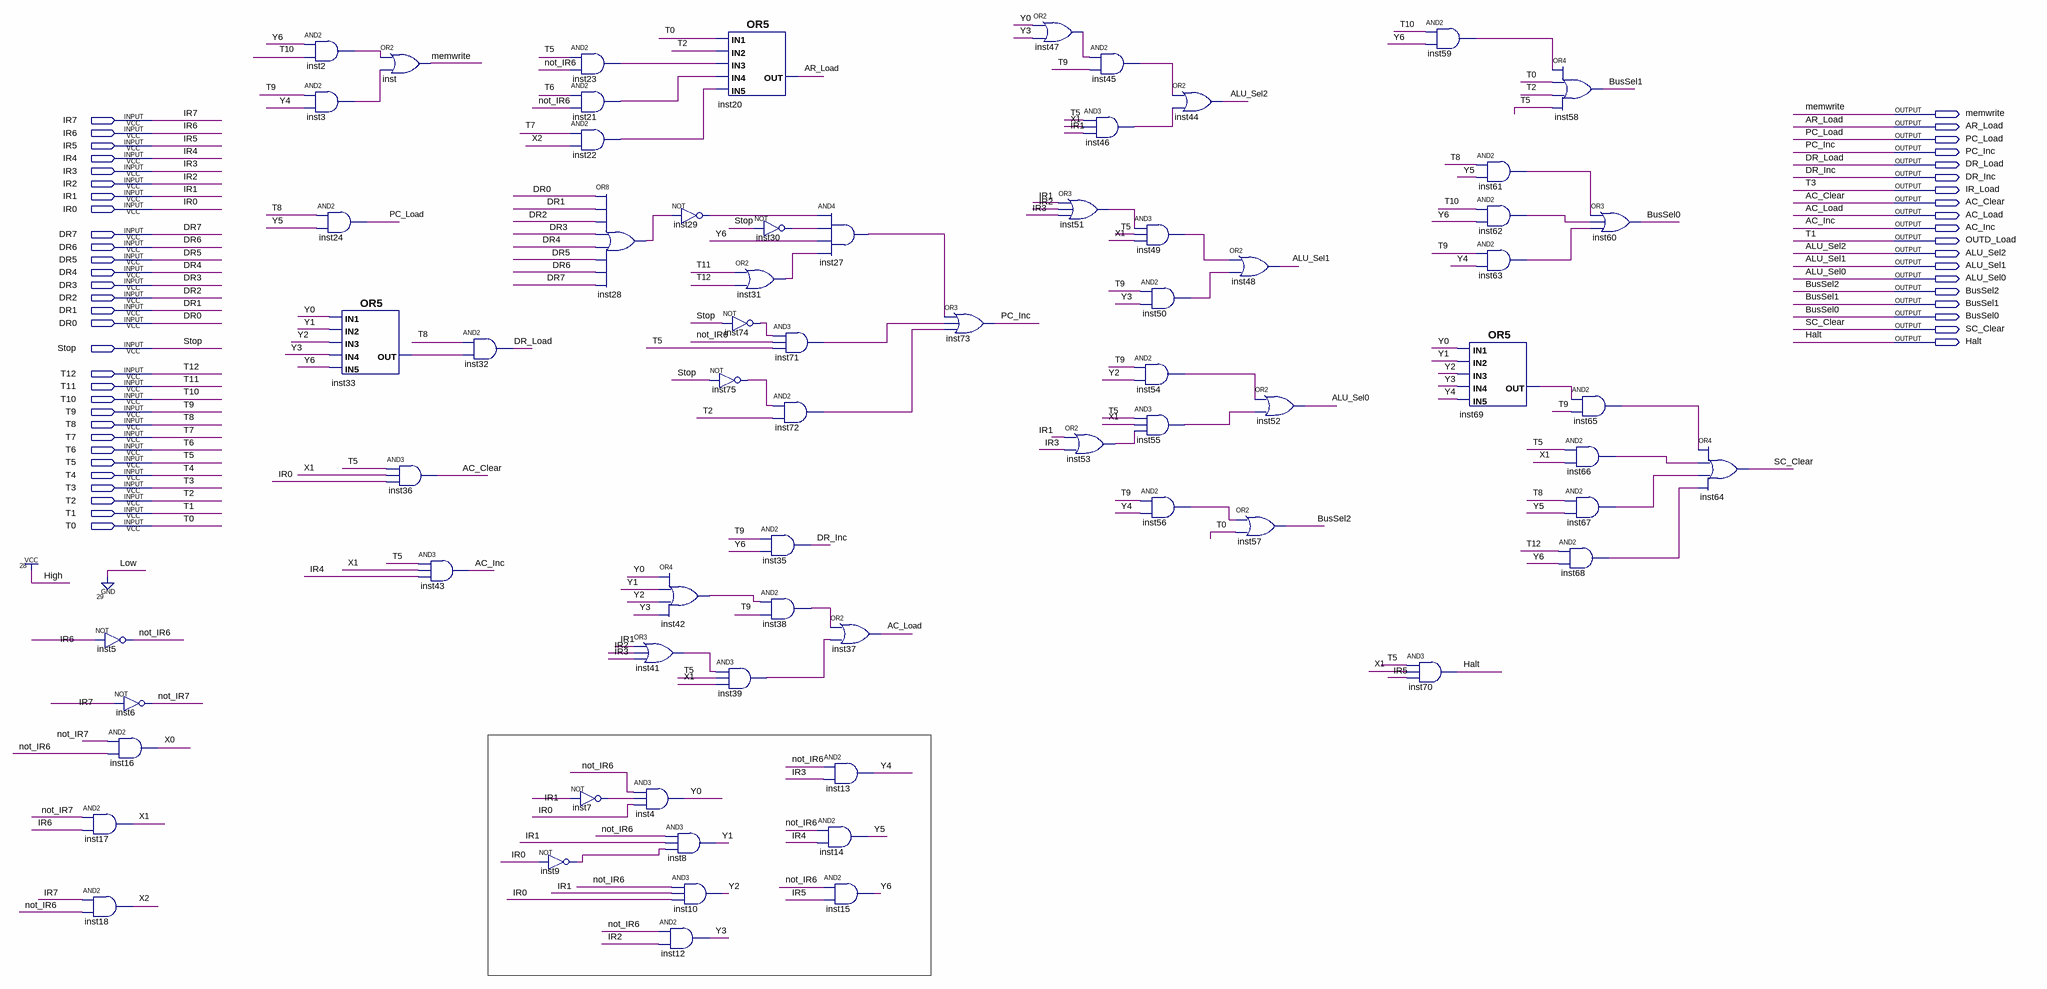
[diagram p0: schematic sheet]
// Quartus schematic lab3controller.bdf as structural Verilog: 69 symbols, 49 pins
module lab3controller (
  input  IR7,
  input  IR6,
  input  IR5,
  input  IR4,
  input  IR3,
  input  IR2,
  input  IR1,
  input  IR0,
  input  DR7,
  input  DR6,
  input  DR5,
  input  DR4,
  input  DR3,
  input  DR2,
  input  DR1,
  input  DR0,
  input  Stop,
  input  T12,
  input  T11,
  input  T10,
  input  T9,
  input  T8,
  input  T7,
  input  T6,
  input  T5,
  input  T4,
  input  T3,
  input  T2,
  input  T1,
  input  T0,
  output memwrite,
  output AR_Load,
  output PC_Load,
  output PC_Inc,
  output DR_Load,
  output DR_Inc,
  output IR_Load,
  output AC_Clear,
  output AC_Load,
  output AC_Inc,
  output OUTD_Load,
  output ALU_Sel2,
  output ALU_Sel1,
  output ALU_Sel0,
  output BusSel2,
  output BusSel1,
  output BusSel0,
  output SC_Clear,
  output Halt
);

  wire inst2_out, inst3_out, inst7_out, inst9_out, inst21_out, inst22_out, inst23_out, inst27_out,
       inst28_out, inst29_out, inst30_out, inst31_out, inst33_out, inst38_out, inst39_out, inst41_out,
       inst42_out, inst45_out, inst46_out, inst47_out, inst49_out, inst50_out, inst51_out, inst53_out,
       inst54_out, inst55_out, inst56_out, inst59_out, inst61_out, inst62_out, inst63_out, inst65_out,
       inst66_out, inst67_out, inst68_out, inst69_out, inst71_out, inst72_out, inst74_out, inst75_out,
       not_IR6, not_IR7, X0, X1, X2, Y0, Y1, Y2, Y3, Y4, Y5, Y6;

  and inst17 (X1, not_IR7, IR6);
  and inst18 (X2, IR7, not_IR6);
  not inst5 (not_IR6, IR6);
  not inst6 (not_IR7, IR7);
  and inst16 (X0, not_IR7, not_IR6);
  and inst2 (inst2_out, Y6, T10);
  and inst3 (inst3_out, T9, Y4);
  and inst24 (PC_Load, T8, Y5);
  or inst33 (inst33_out, Y0, Y1, Y2, Y3, Y6);
  or inst (memwrite, inst2_out, inst3_out);
  and inst36 (AC_Clear, T5, X1, IR0);
  and inst43 (AC_Inc, T5, X1, IR4);
  and inst32 (DR_Load, T8, inst33_out);
  not inst9 (inst9_out, IR0);
  and inst23 (inst23_out, T5, not_IR6);
  and inst21 (inst21_out, T6, not_IR6);
  and inst22 (inst22_out, T7, X2);
  or inst28 (inst28_out, DR0, DR1, DR2, DR3, DR4, DR5, DR6, DR7);
  not inst7 (inst7_out, IR1);
  or inst41 (inst41_out, IR1, IR2, IR3);
  and inst4 (Y0, not_IR6, inst7_out, IR0);
  not inst29 (inst29_out, inst28_out);
  or inst42 (inst42_out, Y0, Y1, Y2, Y3);
  and inst8 (Y1, not_IR6, IR1, inst9_out);
  and inst10 (Y2, not_IR6, IR1, IR0);
  and inst12 (Y3, not_IR6, IR2);
  or inst20 (AR_Load, T0, T2, inst23_out, inst21_out, inst22_out);
  or inst31 (inst31_out, T11, T12);
  not inst74 (inst74_out, Stop);
  not inst75 (inst75_out, Stop);
  and inst39 (inst39_out, inst41_out, T5, X1);
  not inst30 (inst30_out, Stop);
  and inst71 (inst71_out, inst74_out, not_IR6, T5);
  and inst72 (inst72_out, inst75_out, T2);
  and inst35 (DR_Inc, T9, Y6);
  and inst38 (inst38_out, inst42_out, T9);
  and inst27 (inst27_out, inst29_out, inst30_out, Y6, inst31_out);
  or inst37 (AC_Load, inst38_out, inst39_out);
  and inst13 (Y4, not_IR6, IR3);
  and inst14 (Y5, not_IR6, IR4);
  and inst15 (Y6, not_IR6, IR5);
  or inst73 (PC_Inc, inst27_out, inst71_out, inst72_out);
  or inst47 (inst47_out, Y0, Y3);
  and inst45 (inst45_out, inst47_out, T9);
  and inst46 (inst46_out, T5, X1, IR1);
  or inst51 (inst51_out, IR1, IR2, IR3);
  or inst53 (inst53_out, IR1, IR3);
  and inst49 (inst49_out, inst51_out, T5, X1);
  and inst50 (inst50_out, T9, Y3);
  and inst54 (inst54_out, T9, Y2);
  and inst55 (inst55_out, T5, X1, inst53_out);
  and inst56 (inst56_out, T9, Y4);
  or inst44 (ALU_Sel2, inst45_out, inst46_out);
  or inst48 (ALU_Sel1, inst49_out, inst50_out);
  or inst52 (ALU_Sel0, inst54_out, inst55_out);
  or inst57 (BusSel2, inst56_out, T0);
  and inst70 (Halt, T5, X1, IR5);
  and inst59 (inst59_out, T10, Y6);
  or inst69 (inst69_out, Y0, Y1, Y2, Y3, Y4);
  and inst61 (inst61_out, T8, Y5);
  and inst62 (inst62_out, T10, Y6);
  and inst63 (inst63_out, T9, Y4);
  or inst58 (BusSel1, inst59_out, T0, T2, T5);
  and inst68 (inst68_out, T12, Y6);
  or inst60 (BusSel0, inst61_out, inst62_out, inst63_out);
  and inst65 (inst65_out, inst69_out, T9);
  and inst66 (inst66_out, T5, X1);
  and inst67 (inst67_out, T8, Y5);
  or inst64 (SC_Clear, inst65_out, inst66_out, inst67_out, inst68_out);

  assign IR_Load = T3;
  assign OUTD_Load = T1;
endmodule
